# Altium schematic sheet BMS.SchDoc
size A
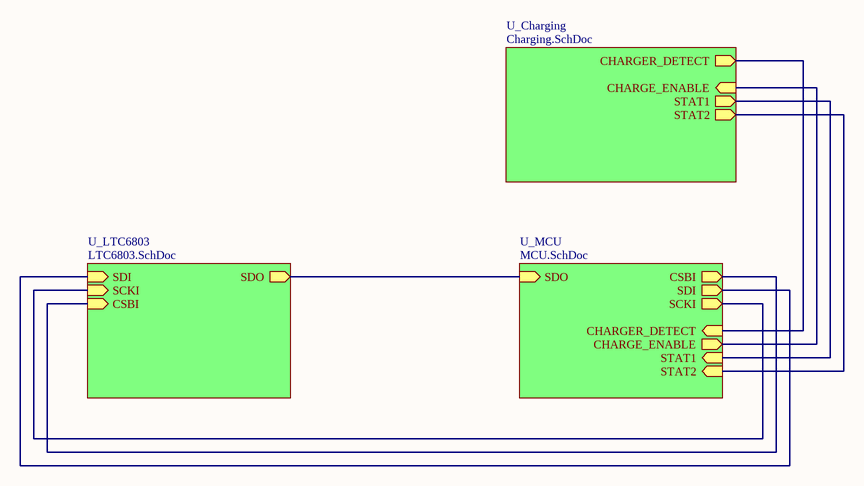
[diagram p0: BMS.SchDoc]

## Sub-sheets
U_Charging = Charging.SchDoc: CHARGER_DETECT (out), CHARGE_ENABLE (in), STAT1 (out), STAT2 (out)
U_LTC6803 = LTC6803.SchDoc: SDI (in), SCKI (in), SDO (out), CSBI (in)
U_MCU = MCU.SchDoc: CSBI (out), SDI (out), SDO (in), SCKI (out), CHARGER_DETECT (in), CHARGE_ENABLE (out), STAT1 (in), STAT2 (in)

## Nets
(unnamed): sheet U_LTC6803/SDI, sheet U_MCU/SDI
(unnamed): sheet U_LTC6803/SCKI, sheet U_MCU/SCKI
(unnamed): sheet U_LTC6803/SDO, sheet U_MCU/SDO
(unnamed): sheet U_LTC6803/CSBI, sheet U_MCU/CSBI
(unnamed): sheet U_MCU/CHARGER_DETECT, sheet U_Charging/CHARGER_DETECT
(unnamed): sheet U_MCU/CHARGE_ENABLE, sheet U_Charging/CHARGE_ENABLE
(unnamed): sheet U_MCU/STAT1, sheet U_Charging/STAT1
(unnamed): sheet U_MCU/STAT2, sheet U_Charging/STAT2